# EasyEDA schematic schematic.json
TITLE: Sheet_1; REV: 1.0; Date: 2024-09-21; Sheet: 1/1; Drawn By: radi8; Company: Your Company
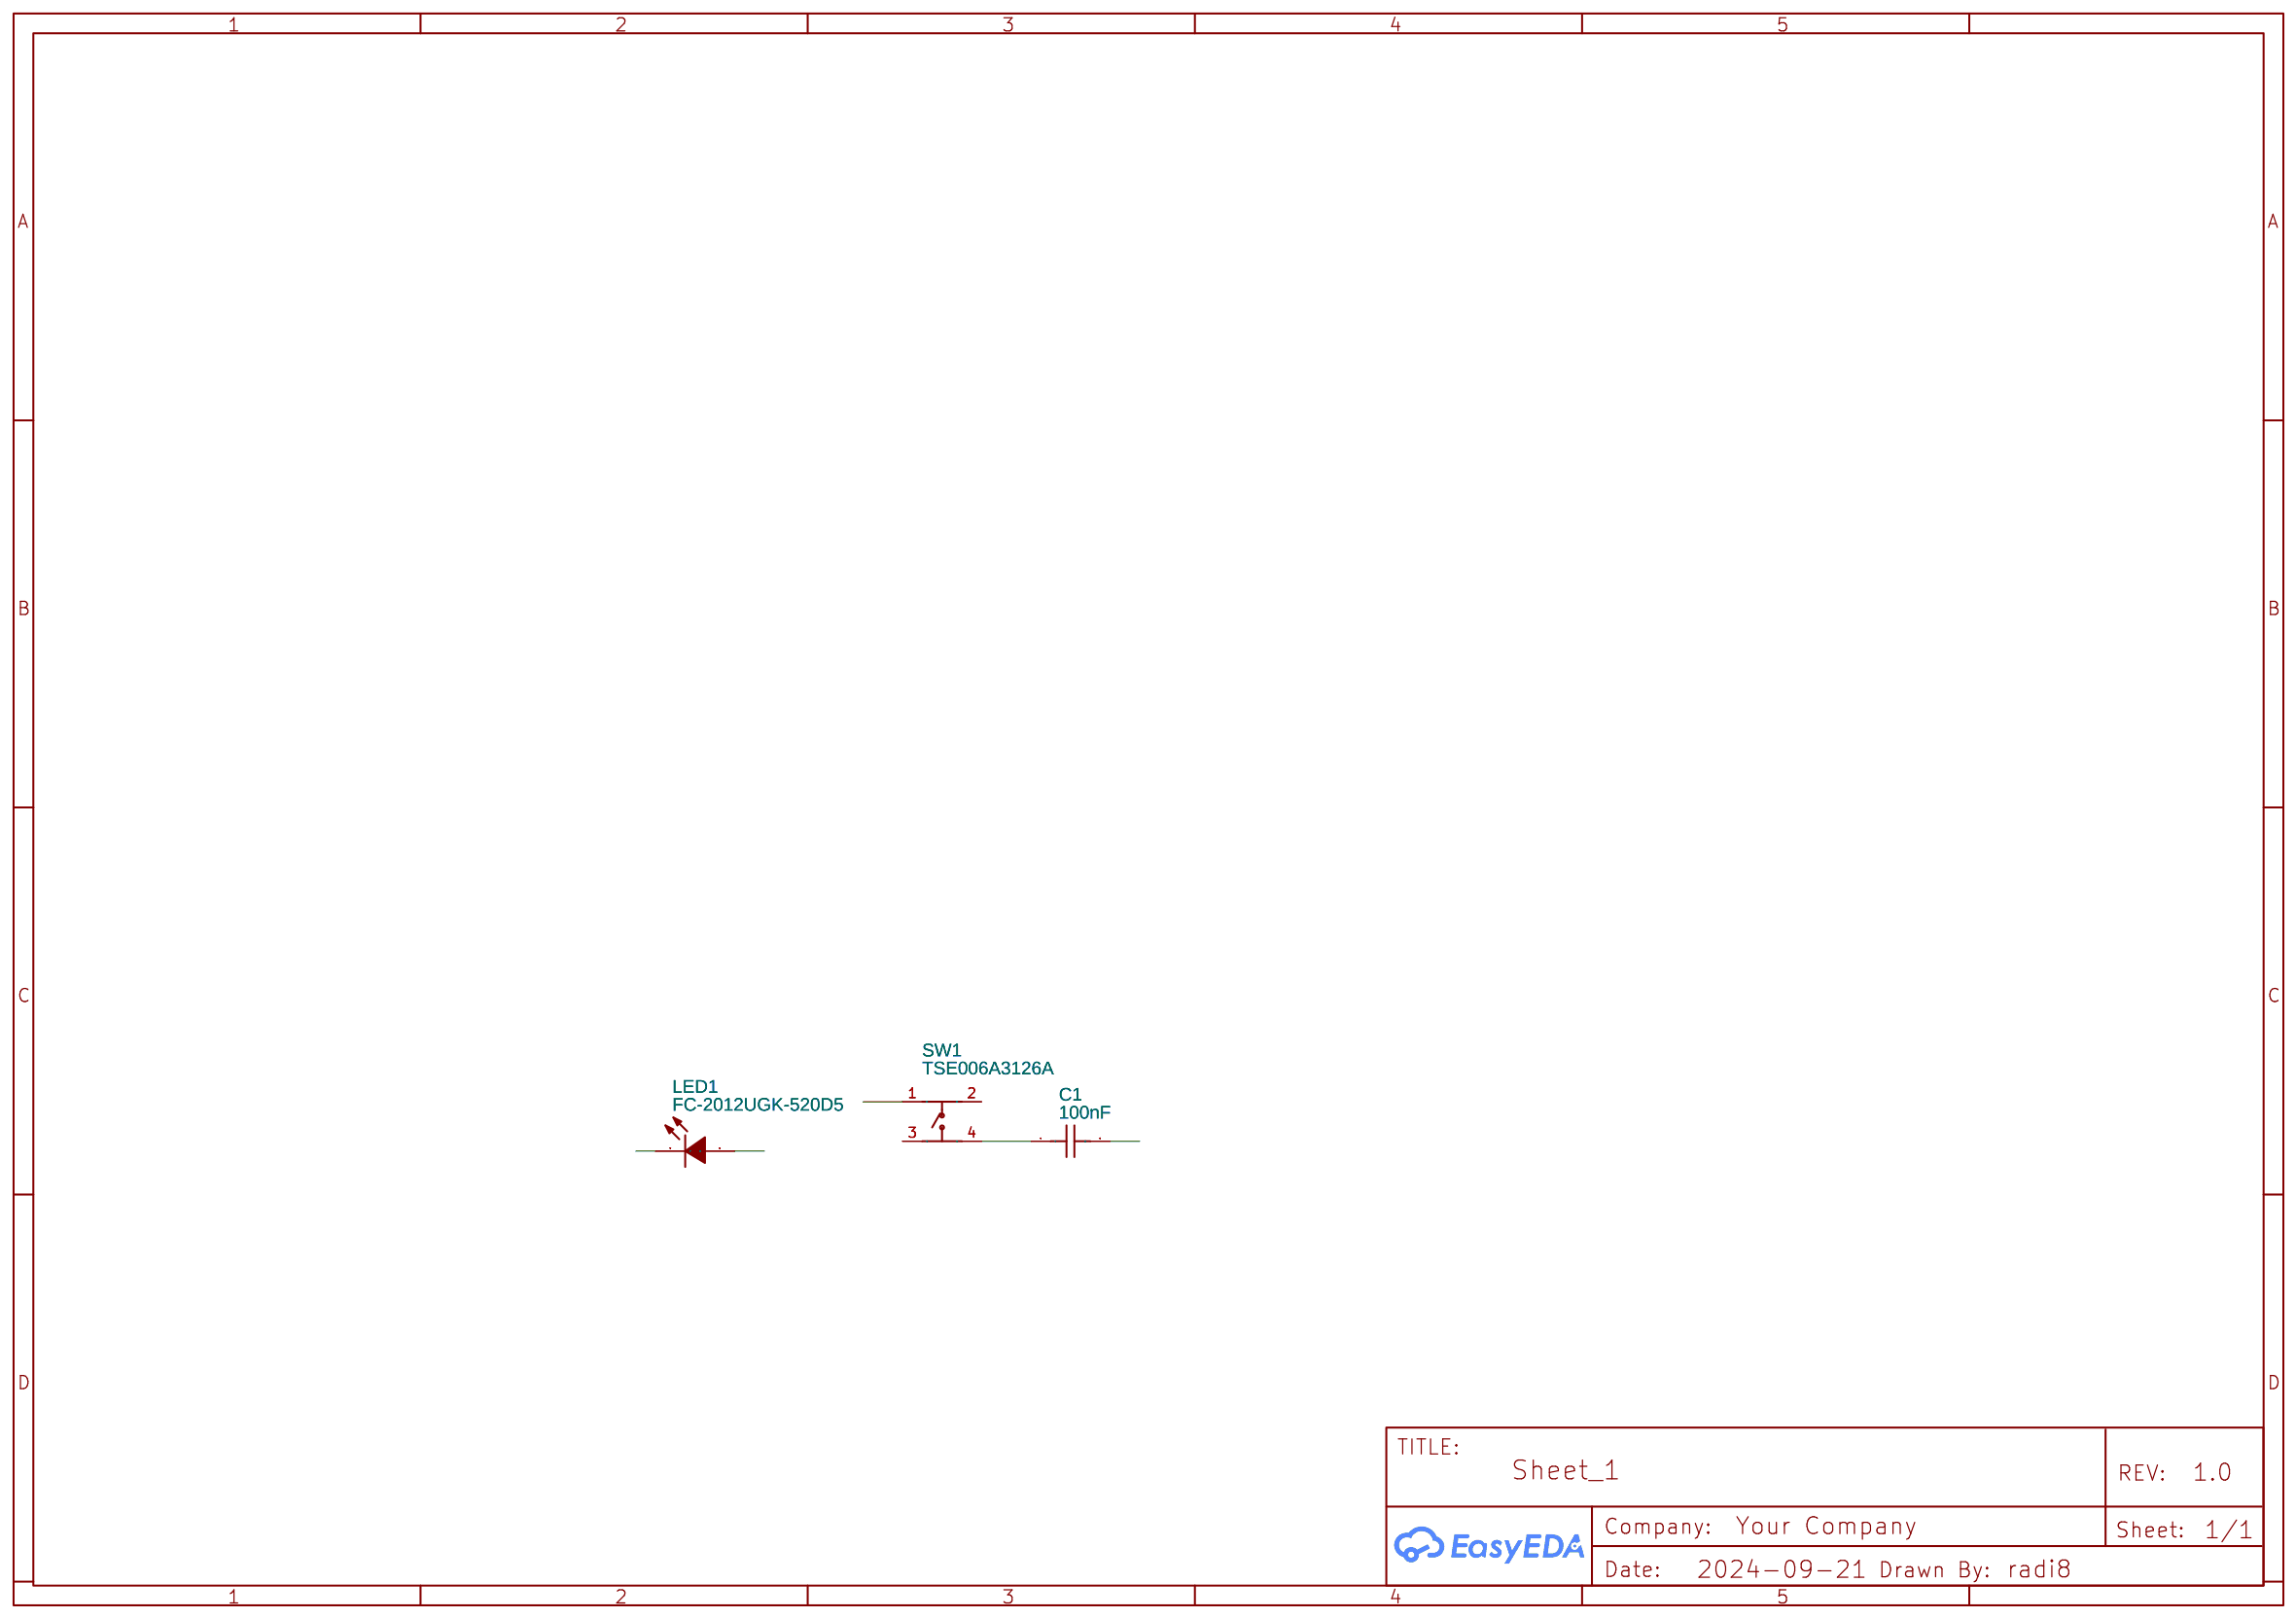
[diagram p0: schematic sheet]

## Parts
C1  100nF  [C0402]
LED1  FC-2012UGK-520D5  [LED0805-R-RD]
SW1  TSE006A3126A  [KEY-SMD_4P-L6.6-W6.4-P4.00-LS9.4]

## Library data of the parts
C1 = CL05B104KO5NNNC: Supplier: LCSC; Manufacturer: SAMSUNG(三星); Supplier Part: C1525; JLCPCB Part Class: Basic Part
LED1 = FC-2012UGK-520D5: Supplier: LCSC; Manufacturer: 国星光电; Manufacturer Part: NCD0805G1; Supplier Part: C84260; JLCPCB Part Class: Extended Part
SW1 = TSE006A3126A: Contributor: LCSC; Supplier: LCSC; Supplier Part: C2888645; Manufacturer: BZCN(博众电气); JLCPCB Part Class: Extended Part

## Nets
Net-(C1-1): C1.1 SW1.4

Not connected (* = marked no-connect by the designer): C1 2; LED1 1(A) 2(K); SW1 1 2 3
